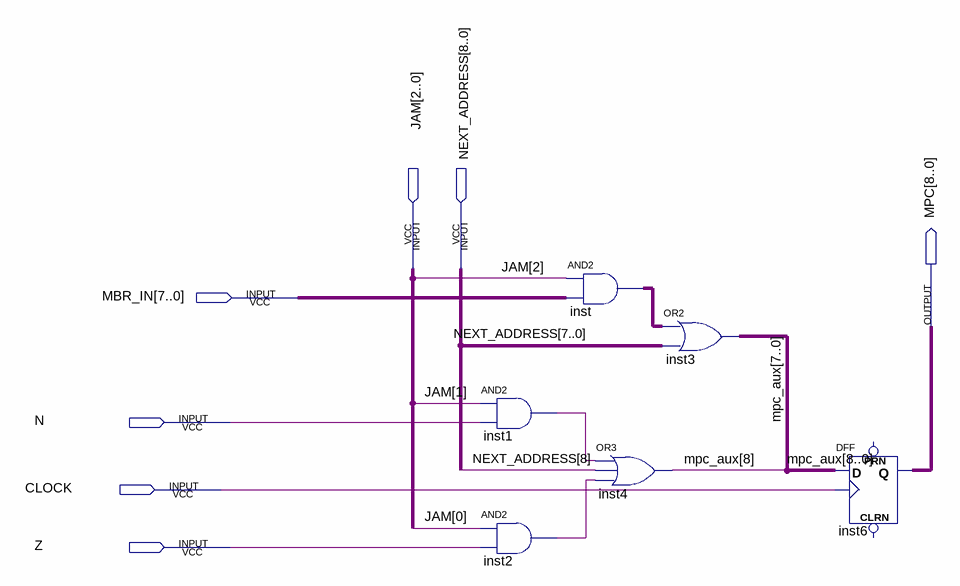
[diagram p0: schematic sheet]
// Quartus schematic mpc_generator.bdf as structural Verilog: 6 symbols, 7 pins
module mpc_generator (
  input  [2:0] JAM,
  input  [8:0] NEXT_ADDRESS,
  input  [7:0] MBR_IN,
  input  N,
  input  CLOCK,
  input  Z,
  output [8:0] MPC
);

  wire inst1_out, inst2_out;
  wire [7:0] inst_out;
  wire [8:0] mpc_aux;

  and inst1 (inst1_out, JAM[1], N);
  and inst2 (inst2_out, JAM[0], Z);
  assign inst_out = {8{JAM[2]}} & MBR_IN;  // AND2 inst, 8 bits wide
  or inst4 (mpc_aux[8], inst1_out, NEXT_ADDRESS[8], inst2_out);
  assign mpc_aux[7:0] = inst_out | NEXT_ADDRESS[7:0];  // OR2 inst3, 8 bits wide
  DFF inst6[8:0] (.CLK(CLOCK), .D(mpc_aux), .Q(MPC));  // open: CLRN, PRN
endmodule
